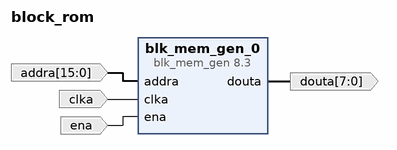
[diagram p0: block diagram of the top level]
# Vivado block design block_rom, xc7a35tcpg236-1, Vivado 2017.2.1
create_bd_design block_rom

create_bd_port -dir I -from 15 -to 0 addra
create_bd_port -dir I -type clk clka
create_bd_port -dir O -from 7 -to 0 douta
create_bd_port -dir I ena

create_bd_cell -type ip -vlnv xilinx.com:ip:blk_mem_gen:8.3 blk_mem_gen_0
set_property -dict [list \
  CONFIG.Memory_Type Single_Port_ROM \
  CONFIG.Enable_32bit_Address false \
  CONFIG.Algorithm Fixed_Primitives \
  CONFIG.Primitive 8kx2 \
  CONFIG.Write_Width_A 8 \
  CONFIG.Write_Depth_A 65536 \
  CONFIG.Enable_A Use_ENA_Pin \
  CONFIG.Register_PortA_Output_of_Memory_Primitives false \
  CONFIG.Load_Init_File true \
  CONFIG.Coe_File ../../../../../../../../camera.coe \
  CONFIG.Fill_Remaining_Memory_Locations false \
  CONFIG.Use_RSTA_Pin false \
  CONFIG.Port_A_Write_Rate 0 \
  CONFIG.Port_B_Clock 0 \
  CONFIG.Port_B_Enable_Rate 0 \
  CONFIG.use_bram_block Stand_Alone \
] [get_bd_cells blk_mem_gen_0]

# ---- connections ----

connect_bd_net [get_bd_ports addra] [get_bd_pins blk_mem_gen_0/addra]
connect_bd_net [get_bd_ports clka] [get_bd_pins blk_mem_gen_0/clka]
connect_bd_net [get_bd_pins blk_mem_gen_0/douta] [get_bd_ports douta]
connect_bd_net [get_bd_ports ena] [get_bd_pins blk_mem_gen_0/ena]

validate_bd_design
save_bd_design
